# Altium schematic sheet [02] - AD7734.SchDoc
size A3
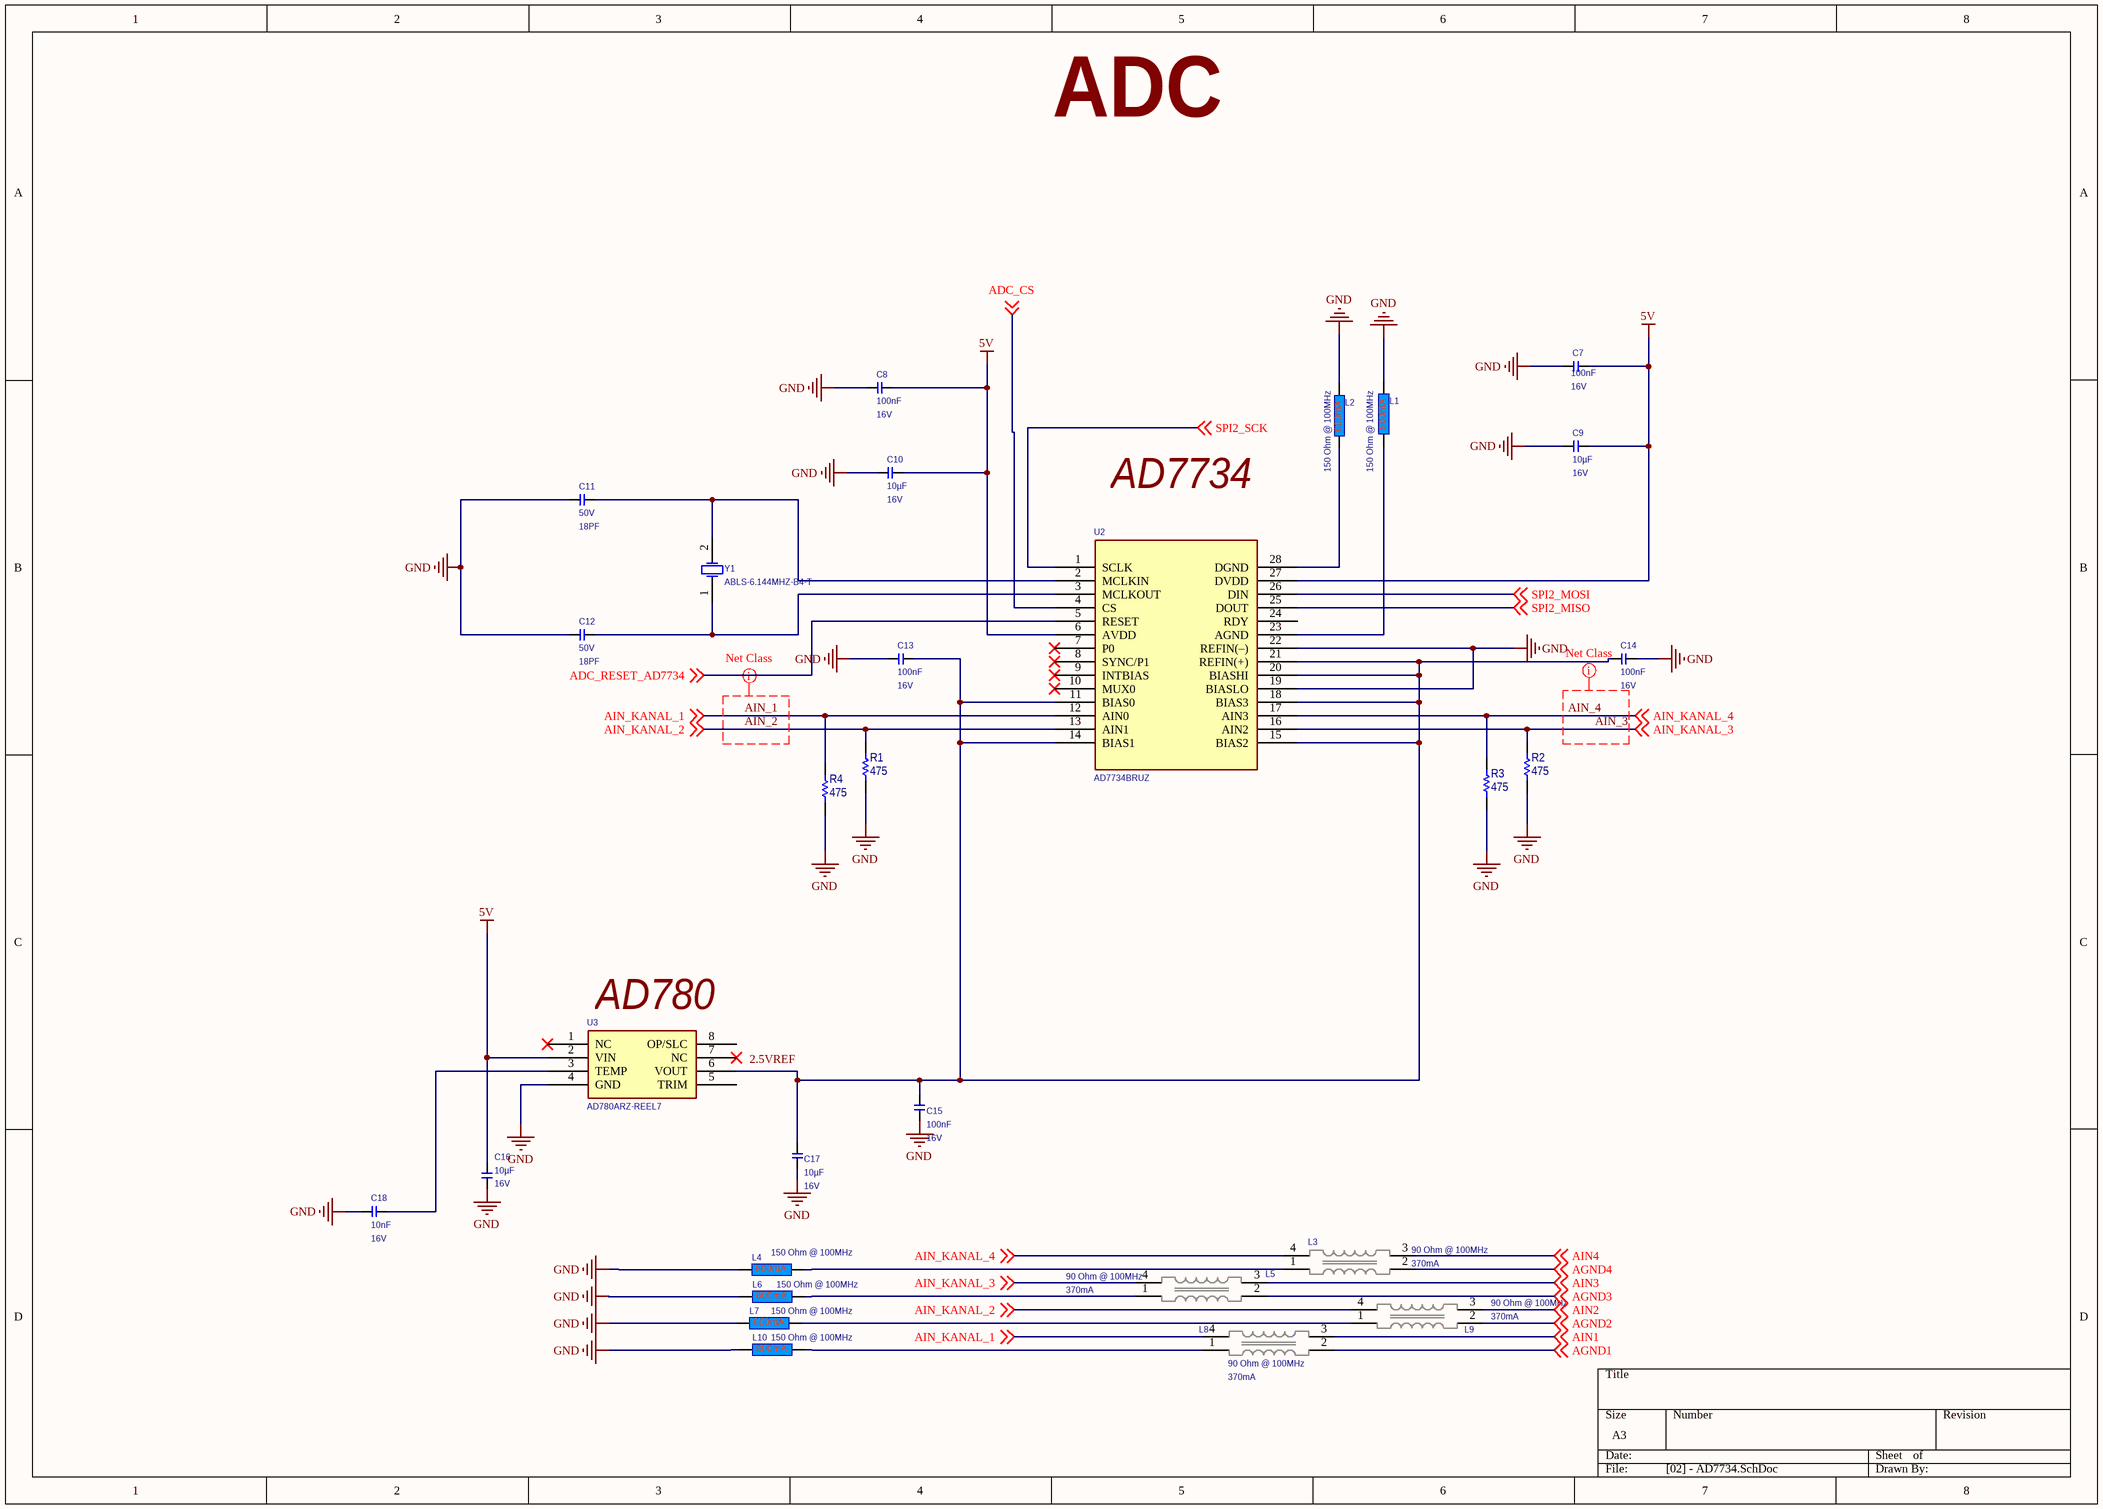
[diagram p0: [02] - AD7734.SchDoc]

## Parts
C7  Voltage - Rated: 16V  [C0805]  (hidden comment: 100nF)
C8  Voltage - Rated: 16V  [C0805]  (hidden comment: 100nF)
C9  Voltage - Rated: 16V  [C0805]  (hidden comment: 10µF)
C10  Voltage - Rated: 16V  [C0805]  (hidden comment: 10µF)
C11  voltage_rating_dc: 50V  [C0805]  (hidden comment: 18PF)
C12  voltage_rating_dc: 50V  [C0805]  (hidden comment: 18PF)
C13  Voltage - Rated: 16V  [C0805]  (hidden comment: 100nF)
C14  Voltage - Rated: 16V  [C0805]  (hidden comment: 100nF)
C15  Voltage - Rated: 16V  [C0805]  (hidden comment: 100nF)
C16  Voltage - Rated: 16V  [C0805]  (hidden comment: 10µF)
C17  Voltage - Rated: 16V  [C0805]  (hidden comment: 10µF)
C18  Voltage - Rated: 16V  [C0805]  (hidden comment: 10nF)
L1  150 Ohm @ 100MHz  [0805]
L2  150 Ohm @ 100MHz  [0805]
L3  Current Rating (Max): 370mA  [FILTER]  (hidden comment: 90 Ohm @ 100MHz)
L4  150 Ohm @ 100MHz  [0805]
L5  Current Rating (Max): 370mA  [FILTER]  (hidden comment: 90 Ohm @ 100MHz)
L6  150 Ohm @ 100MHz  [0805]
L7  150 Ohm @ 100MHz  [0805]
L8  Current Rating (Max): 370mA  [FILTER]  (hidden comment: 90 Ohm @ 100MHz)
L9  Current Rating (Max): 370mA  [FILTER]  (hidden comment: 90 Ohm @ 100MHz)
L10  150 Ohm @ 100MHz  [0805]
R1  Resistance (Ohms): 475  [R1206]  (hidden comment: RES SMD 475 OHM 1206)
R2  Resistance (Ohms): 475  [R1206]  (hidden comment: RES SMD 475 OHM 1206)
R3  Resistance (Ohms): 475  [R1206]  (hidden comment: RES SMD 475 OHM 1206)
R4  Resistance (Ohms): 475  [R1206]  (hidden comment: RES SMD 475 OHM 1206)
U2  AD7734BRUZ  [TSSOP-28]
U3  Manufacturer Part Number: AD780ARZ-REEL7  [SOIC-8]  (hidden comment: AD780ARZ)
Y1  Manufacturer Part Number: ABLS-6.144MHZ-B4-T  [HEADER,2PİN ADC]  (hidden comment: ABLS-6.144MHZ)

## Nets
5V: C7.2 C8.2 C9.2 C10.2 C16.2 U2.6(AVDD) U2.27(DVDD) U3.2(VIN)
GND: C7.1 C8.1 C9.1 C10.1 C11.1 C12.1 C13.1 C14.2 C15.2 C16.1 C17.1 C18.1 L1.2 L2.2 L4.1 L6.1 L7.1 L10.1 R1.1 R2.1 R3.1 R4.1 U2.19(BIASLO) U2.22(REFIN(–)) U3.4(GND)
ADC_CS: U2.4(CS) ; off-sheet ADC_CS
ADC_RESET_AD7734: U2.5(RESET) ; off-sheet ADC_RESET_AD7734
AGND1: L8.2 ; off-sheet AGND1
AGND2: L9.2 ; off-sheet AGND2
AGND3: L5.2 ; off-sheet AGND3
AGND4: L3.2 ; off-sheet AGND4
AIN1: L8.3 ; off-sheet AIN1
AIN2: L9.3 ; off-sheet AIN2
AIN3: L5.3 ; off-sheet AIN3
AIN4: L3.3 ; off-sheet AIN4
AIN_1: L8.4 R4.2 U2.12(AIN0) ; off-sheet AIN_KANAL_1  [also labelled AIN_KANAL_1]
AIN_2: L9.4 R1.2 U2.13(AIN1) ; off-sheet AIN_KANAL_2  [also labelled AIN_KANAL_2]
AIN_3: L5.4 R2.2 U2.16(AIN2) ; off-sheet AIN_KANAL_3  [also labelled AIN_KANAL_3]
AIN_4: L3.4 R3.2 U2.17(AIN3) ; off-sheet AIN_KANAL_4  [also labelled AIN_KANAL_4]
SPI2_MISO: U2.25(DOUT) ; off-sheet SPI2_MISO
SPI2_MOSI: U2.26(DIN) ; off-sheet SPI2_MOSI
SPI2_SCK: U2.1(SCLK) ; off-sheet SPI2_SCK
NetC11_2: C11.2 U2.2(MCLKIN) Y1.2(OSC2)
NetC12_2: C12.2 U2.3(MCLKOUT) Y1.1(OSC1)
NetC13_2: C13.2 C14.1 C15.1 C17.2 U2.11(BIAS0) U2.14(BIAS1) U2.15(BIAS2) U2.18(BIAS3) U2.20(BIASHI) U2.21(REFIN(+)) U3.6(VOUT)
NetC18_2: C18.2 U3.3(TEMP)
NetL1_1: L1.1 U2.23(AGND)
NetL2_1: L2.1 U2.28(DGND)
NetL3_1: L3.1 L4.2
NetL5_1: L5.1 L6.2
NetL7_2: L7.2 L9.1
NetL8_1: L8.1 L10.2

Not connected (* = marked no-connect by the designer): U2 7(P0)* 8(SYNC/P1)* 9(INTBIAS)* 10(MUX0)* 24(RDY); U3 1(NC)* 5(TRIM) 7(NC)* 8(OP/SLC)

## Layout directives
net class ADC_IN: AIN_1, AIN_2, AIN_3, AIN_4

## Notes on the sheet
- ADC
- AD7734
- (near U3) AD780
- Labels drawn without touching a wire or pin: 2.5VREF

## Library data of the parts
C7 C8 C13-C15 = C-100NF,16V,0805: AVX - 0805YA103JAT2A - CAP, MLCC, C0G/NP0, 10NF, 16V, 0805; Tolerance: ±5%; Temperature Coefficient: C0G, NP0; Manufacturer: AVX; Manufacturer Part Number: 0805YA103JAT2A; RoHS: YES; ComponentLink1URL: http://www.avx.com/docs/Catalogs/ccog.pdf; ComponentLink1Description: http://www.avx.com/docs/Catalogs/ccog.pdf; ComponentLink2URL: http://www.farnell.com/datasheets/1825494.pdf; ComponentLink2Description: http://www.farnell.com/datasheets/1825494.pdf; Supplier 1: Digi-Key; Category: Capacitors; Stock 1: 28062; Pricing 1: 1=0.29, 10=0.204, 25=0.1668, 50=0.1424, 100=0.1221, 250=0.10176, 500=0.09158, 1000=0.07733 (USD); Packaging: Cut Tape (CT); Mounting Type: Surface Mount, MLCC; Operating Temperature: -55°C ~ 125°C; Applications: General Purpose; Ratings: -; Package / Case: 0805 (2012 Metric); Size / Dimension: 0.079" L x 0.049" W (2.01mm x 1.25mm); Height - Seated (Max): -; Thickness (Max): 0.037" (0.94mm); Lead Spacing: -; Features: -; Lead Style: -; ComponentLink3URL: http://datasheets.avx.com/C0GNP0-Dielectric.pdf; ComponentLink3Description: http://datasheets.avx.com/C0GNP0-Dielectric.pdf; Supplier Part Number 1: 478-1334-1-ND; Capacitance: 100nF
C9 C10 C16 C17 = C-10UF,16V,0805: AVX - 0805YD106KAT2A - CAP, MLCC, X5R, 10UF, 16V, 0805; Manufacturer: AVX Corporation; Tolerance: ±10%; Supplier 1: Digi-Key; Manufacturer Part Number: 0805YD106KAT2A; RoHS: RoHS Compliant; Category: Capacitors; Stock 1: 293738; Pricing 1: 1=0.18, 10=0.124, 25=0.0908, 50=0.0742, 100=0.0627, 250=0.05116, 500=0.0429, 1000=0.03795 (USD); Packaging: Digi-Reel®; Temperature Coefficient: X5R; Mounting Type: Surface Mount, MLCC; Operating Temperature: -55°C ~ 85°C; Applications: General Purpose; Ratings: -; Package / Case: 0805 (2012 Metric); Size / Dimension: 0.079" L x 0.049" W (2.01mm x 1.25mm); Height - Seated (Max): -; Thickness (Max): 0.055" (1.40mm); Lead Spacing: -; Features: -; Lead Style: -; ComponentLink1URL: http://datasheets.avx.com/cx5r.pdf; ComponentLink1Description: http://datasheets.avx.com/cx5r.pdf; Supplier Part Number 1: 478-5165-6-ND; Capacitance: 10µF
C11 C12 = C-18PF,50V,0805: MULTICOMP - MC0805N180J500CT - CAP, MLCC, C0G/NP0, 18PF, 50V,0805, REEL; capacitance_tolerance: ±5%; pin_count: 2; Supplier 1: Octopart; Manufacturer: Multicomp; Manufacturer Part Number: MC0805N180J500CT; Stock 1: 3187; Pricing 1: 1=0.11400, 10=0.07300, 50=0.04100, 100=0.03200, 250=0.02600, 500=0.02200, 1000=0.01800 (USD); reach_svhc_compliance: No SVHC; rohs_status: Compliant; dielectric_characteristic: C0G/NP0; Octopart Url: http://octopart.com/mc0805n180j500ct-multicomp-10529169; Seller Landing  Url: https://octopart-clicks.com/click/track?country=TR&ak=8157f166&sig=03c9fd1&sid=2402&ppid=10529169&vpid=17760821&ct=offers; OctopartID: 811748bd0de05ed0; ComponentLink1URL: http://datasheet.octopart.com/MC0805N180J500CT-Multicomp-datasheet-16478625.pdf; ComponentLink1Description: http://datasheet.octopart.com/MC0805N180J500CT-Multicomp-datasheet-16478625.pdf; ComponentLink2URL: http://datasheet.octopart.com/MC0805N180J500CT-Multicomp-datasheet-22150886.pdf; ComponentLink2Description: http://datasheet.octopart.com/MC0805N180J500CT-Multicomp-datasheet-22150886.pdf; ComponentLink3URL: http://datasheet.octopart.com/MC0805N180J500CT-Multicomp-datasheet-8445804.pdf; ComponentLink3Description: http://datasheet.octopart.com/MC0805N180J500CT-Multicomp-datasheet-8445804.pdf; ComponentLink4URL: http://datasheet.octopart.com/MC0805N180J500CT-Multicomp-datasheet-34215986.pdf; ComponentLink4Description: http://datasheet.octopart.com/MC0805N180J500CT-Multicomp-datasheet-34215986.pdf; ComponentLink5URL: http://datasheet.octopart.com/MC0805N180J500CT-Multicomp-datasheet-26590290.pdf; ComponentLink5Description: http://datasheet.octopart.com/MC0805N180J500CT-Multicomp-datasheet-26590290.pdf; ComponentLink6URL: http://datasheet.octopart.com/MC0805N180J500CT-Multicomp-datasheet-15500401.pdf; ComponentLink6Description: http://datasheet.octopart.com/MC0805N180J500CT-Multicomp-datasheet-15500401.pdf; ComponentLink7URL: http://datasheet.octopart.com/MC0805N180J500CT-Multicomp-datasheet-10838970.pdf; ComponentLink7Description: http://datasheet.octopart.com/MC0805N180J500CT-Multicomp-datasheet-10838970.pdf; Supplier Part Number 1: Newark - 06R4039; capacitance: 18PF
C18 = C-10NF,0805: CAP CER 10000PF 16V NP0 0805; Manufacturer: AVX Corporation; Manufacturer Part Number: 0805YA103JAT2A; Tolerance: ±5%; Temperature Coefficient: C0G, NP0; Supplier 1: Digi-Key; RoHS: RoHS Compliant; Category: Capacitors; Stock 1: 28062; Pricing 1: 1=0.29, 10=0.204, 25=0.1668, 50=0.1424, 100=0.1221, 250=0.10176, 500=0.09158, 1000=0.07733 (USD); Packaging: Cut Tape (CT); Mounting Type: Surface Mount, MLCC; Operating Temperature: -55°C ~ 125°C; Applications: General Purpose; Ratings: -; Package / Case: 0805 (2012 Metric); Size / Dimension: 0.079" L x 0.049" W (2.01mm x 1.25mm); Height - Seated (Max): -; Thickness (Max): 0.037" (0.94mm); Lead Spacing: -; Features: -; Lead Style: -; ComponentLink1URL: http://datasheets.avx.com/C0GNP0-Dielectric.pdf; ComponentLink1Description: http://datasheets.avx.com/C0GNP0-Dielectric.pdf; Supplier Part Number 1: 478-1334-1-ND; Capacitance: 10nF
L1 L2 L4 L6 L7 L10 = L-150OHM,800MA: FERRITE 800MA 150 OHM 0805 SMD; Manufacturer: Laird-Signal Integrity Products; Manufacturer Part Number: LI0805H151R-10; DC Resistance (DCR): 150 mOhm Max; Filter Type: Differential Mode - Single; Supplier 1: Digi-Key; RoHS: RoHS Compliant; Category: Filters; Stock 1: 418596; Pricing 1: 1=0.1, 10=0.07, 25=0.064, 50=0.0574, 100=0.0421, 250=0.03064, 500=0.02808, 1000=0.02424 (USD); Packaging: Cut Tape (CT); Current Rating: 800mA; Package / Case: 0805 (2012 Metric); Mounting Type: Surface Mount; Height (Max): 0.043" (1.10mm); Size / Dimension: 0.079" L x 0.049" W (2.00mm x 1.25mm); ComponentLink1URL: http://www.lairdtech.com/WorkArea/linkit.aspx?LinkIdentifier=id&ItemID=4912; ComponentLink1Description: http://www.lairdtech.com/WorkArea/linkit.aspx?LinkIdentifier=id&ItemID=4912; Supplier Part Number 1: 240-2384-1-ND; Impedance @ Frequency: 150 Ohm @ 100MHz
L3 L5 L8 L9 = L-CMC 90 OHM 370MA 2 LN SMD: CMC 90 OHM 370MA 2 LN SMD; Manufacturer: Abracon LLC; Manufacturer Part Number: ACM-31-900M-T; Filter Type: Signal Line; Number of Lines: 2; DC Resistance (DCR) (Max): 300 mOhm; Voltage Rating - DC: 50V; Supplier 1: Digi-Key; RoHS: RoHS Compliant; Category: Filters; Stock 1: 3796; Pricing 1: 1=0.5, 10=0.44, 25=0.4124, 50=0.3576, 100=0.33, 250=0.31352, 500=0.286, 1000=0.242 (USD); Packaging: Cut Tape (CT); Inductance @ Frequency: -; Voltage Rating - AC: -; Operating Temperature: -40°C ~ 85°C; Ratings: -; Approvals: -; Features: -; Mounting Type: Surface Mount; Size / Dimension: 0.118" L x 0.063" W (3.00mm x 1.60mm); Height (Max): 0.079" (2.00mm); Package / Case: Horizontal, 4 PC Pad; ComponentLink1URL: http://www.abracon.com/Magnetics/chokes/ACM-31.pdf; ComponentLink1Description: http://www.abracon.com/Magnetics/chokes/ACM-31.pdf; Supplier Part Number 1: 535-12752-1-ND; Impedance @ Frequency: 90 Ohm @ 100MHz
R1-R4 = R-475R,1206: RES SMD 475 OHM 1% 1/2W 1206; Manufacturer: Stackpole Electronics Inc.; Manufacturer Part Number: RNCP1206FTD475R; Power (Watts): 0.5W, 1/2W; Temperature Coefficient: ±100ppm/°C; Supplier 1: Digi-Key; RoHS: RoHS Compliant; Category: Resistors; Stock 1: 673911; Pricing 1: 1=0.1, 10=0.049, 50=0.0272, 100=0.0201, 250=0.01536, 500=0.01228, 1000=0.00904, 2500=0.00784 (USD); Packaging: Cut Tape (CT); Part Status: Active; Tolerance: ±1%; Composition: Thin Film; Features: Anti-Sulfur, Moisture Resistant; Operating Temperature: -55°C ~ 155°C; Package / Case: 1206 (3216 Metric); Supplier Device Package: 1206; Size / Dimension: 0.122" L x 0.059" W (3.10mm x 1.50mm); Height: 0.024" (0.60mm); Number of Terminations: 2; Failure Rate: -; ComponentLink1URL: http://www.seielect.com/catalog/SEI-RNCP.pdf; ComponentLink1Description: http://www.seielect.com/catalog/SEI-RNCP.pdf; Supplier Part Number 1: RNCP1206FTD475RCT-ND
U2 = IC-AD7734BRUZ: IC ADC 24BIT 4-CH 28-TSSOP; Manufacturer: Analog Devices Inc.; Number of Bits: 24; Sampling Rate (Per Second): 15.4k; Number of Inputs: 4; Input Type: Single Ended; Data Interface: SPI, DSP; Configuration: MUX-ADC; Number of A/D Converters: 1; Architecture: Sigma-Delta; Reference Type: External; Voltage - Supply, Analog: 5V; Voltage - Supply, Digital: 2.7 V ~ 3.6 V, 5V; Supplier 1: Digi-Key; RoHS: RoHS Compliant; Category: Integrated Circuits (ICs); Stock 1: 383; Pricing 1: 1=20.47, 10=18.882, 100=16.1242, 500=14.63904, 1000=13.7904, 2500=13.36608, 5000=13.056 (USD); Packaging: Tube; Ratio - S/H:ADC: -; Features: True Bipolar; Operating Temperature: -40°C ~ 105°C; Package / Case: 28-TSSOP (0.173", 4.40mm Width); Supplier Device Package: 28-TSSOP; ComponentLink1URL: http://www.analog.com/media/en/technical-documentation/data-sheets/AD7734.pdf; ComponentLink1Description: http://www.analog.com/media/en/technical-documentation/data-sheets/AD7734.pdf; Supplier Part Number 1: AD7734BRUZ-ND; Manufacturer Part Number: AD7734BRUZ
U3 = IC-AD780ARZ: IC VREF SERIES/SHUNT PROG 8SOIC; Manufacturer: Analog Devices Inc.; Reference Type: Series, Shunt; Output Type: Programmable; Voltage - Output (Min/Fixed): ±2.5V, ±3V; Current - Output: 10mA; Tolerance: ±0.2%, ±0.17%; Temperature Coefficient: 7ppm/°C; Noise - 0.1Hz to 10Hz: 4µVp-p; Voltage - Input: 4 V ~ 36 V; Current - Supply: 1mA; Supplier 1: Digi-Key; RoHS: RoHS Compliant; Category: Integrated Circuits (ICs); Stock 1: 1014; Pricing 1: 1=10.53, 10=9.545, 100=7.8685, 500=6.8796 (USD); Packaging: Cut Tape (CT); Voltage - Output (Max): -; Noise - 10Hz to 10kHz: -; Current - Cathode: 1mA; Operating Temperature: -40°C ~ 85°C (TA); Mounting Type: Surface Mount; Package / Case: 8-SOIC (0.154", 3.90mm Width); Supplier Device Package: 8-SOIC; ComponentLink1URL: http://www.analog.com/media/en/technical-documentation/data-sheets/AD780.pdf; ComponentLink1Description: http://www.analog.com/media/en/technical-documentation/data-sheets/AD780.pdf; Supplier Part Number 1: AD780ARZ-REEL7CT-ND
Y1 = OSC-ABLS-6.144MHZ-B4-T: CRYSTAL 6.1440MHZ 18PF SMD; Manufacturer: Abracon LLC; Frequency Stability: ±50ppm; Frequency Tolerance: ±30ppm; ESR (Equivalent Series Resistance): 100 Ohm; Operating Mode: Fundamental; Supplier 1: Digi-Key; RoHS: RoHS Compliant; Category: Crystals and Oscillators; Stock 1: 3930; Pricing 1: 1=0.35, 10=0.289, 50=0.2596, 100=0.231, 500=0.22 (USD); Packaging: Cut Tape (CT); Type: MHz Crystal; Frequency: 6.144MHz; Load Capacitance: 18pF; Operating Temperature: -20°C ~ 70°C; Ratings: -; Mounting Type: Surface Mount; Package / Case: HC49/US; Size / Dimension: 0.449" L x 0.185" W (11.40mm x 4.70mm); Height: 0.165" (4.20mm); ComponentLink1URL: http://www.abracon.com/Resonators/abls.pdf; ComponentLink1Description: http://www.abracon.com/Resonators/abls.pdf; Supplier Part Number 1: 535-10209-1-ND